# EAGLE board AllOfTheAbove7x13nov (EAGLE 7.7.0)
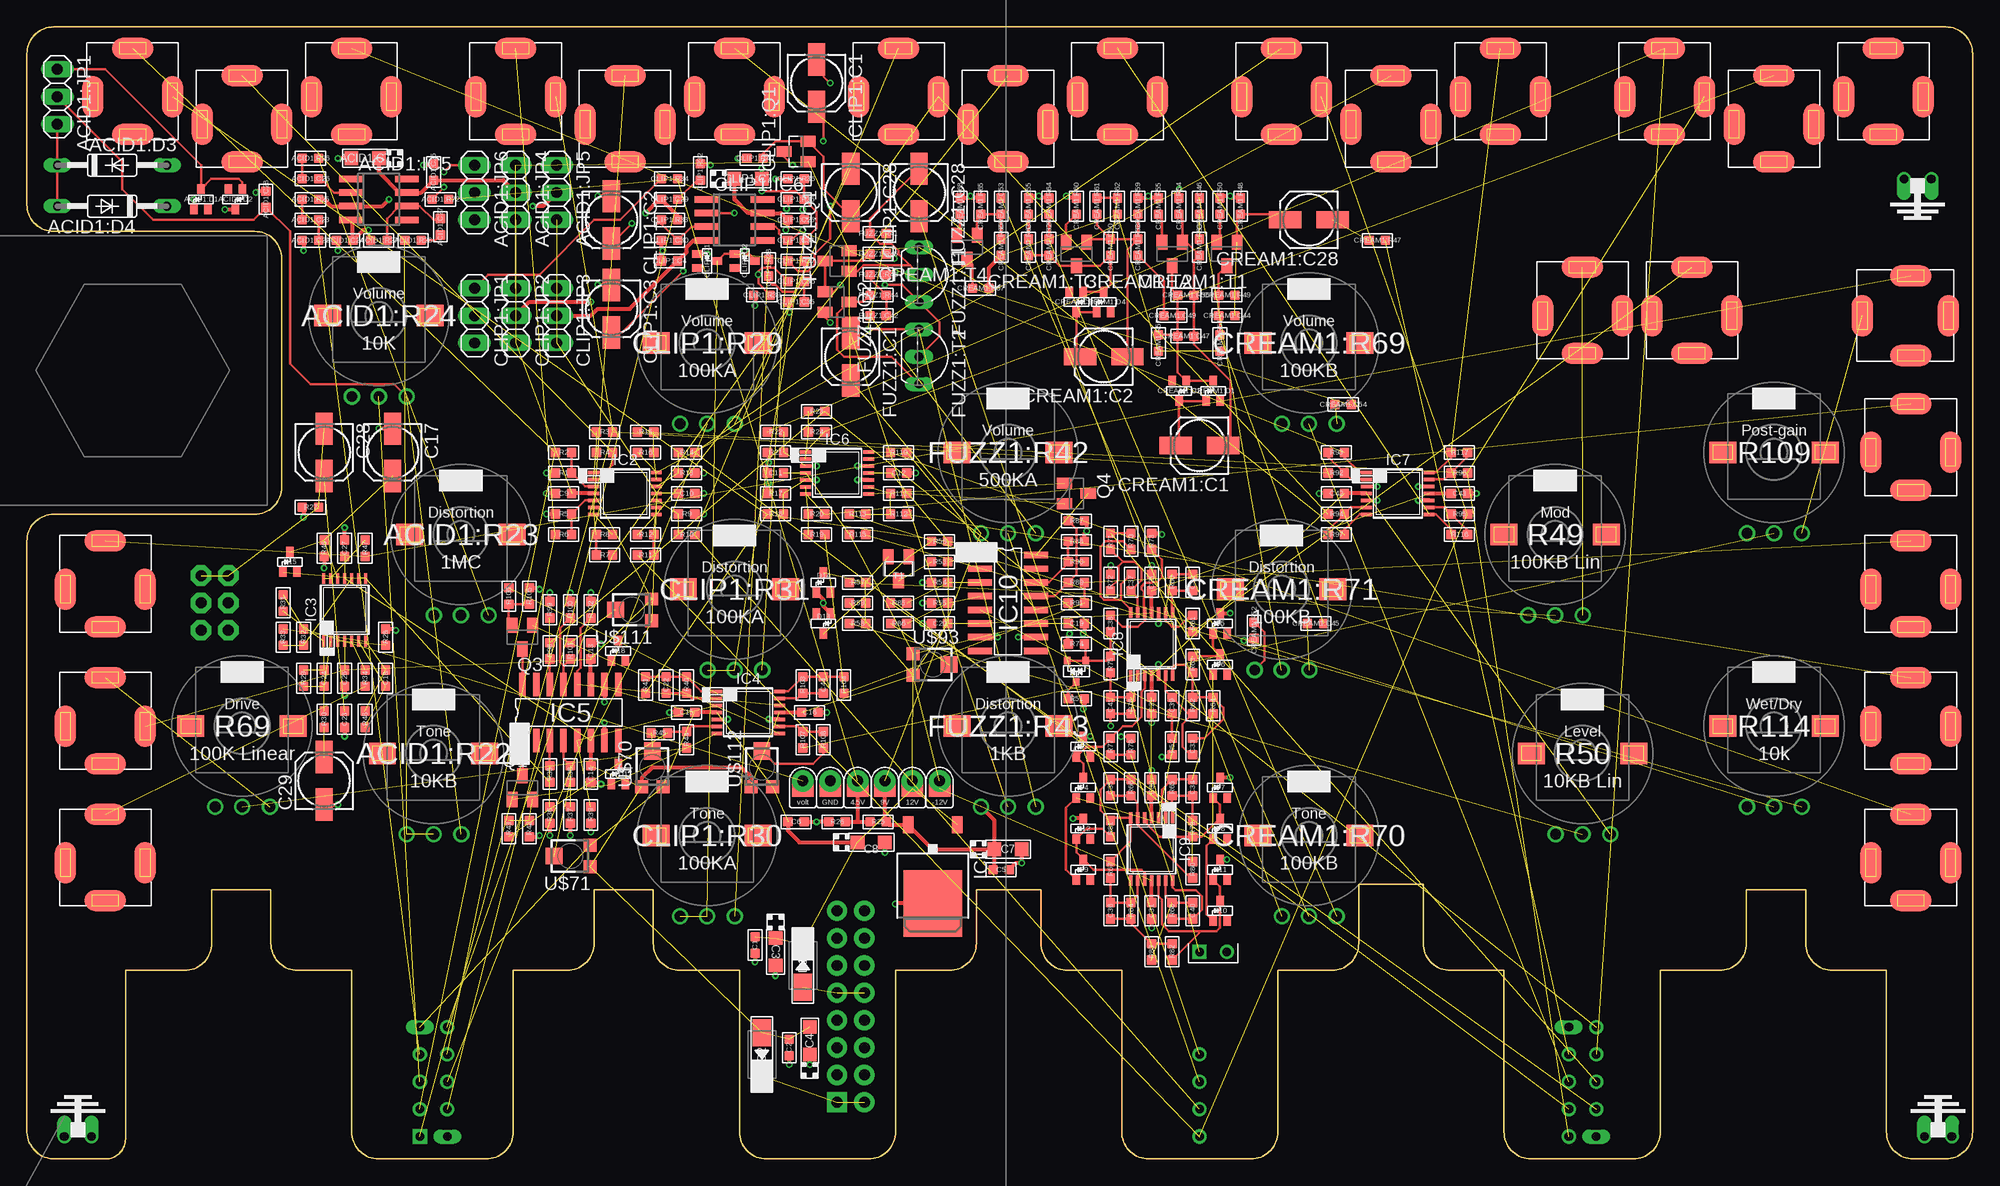
[diagram p10: board, top side]
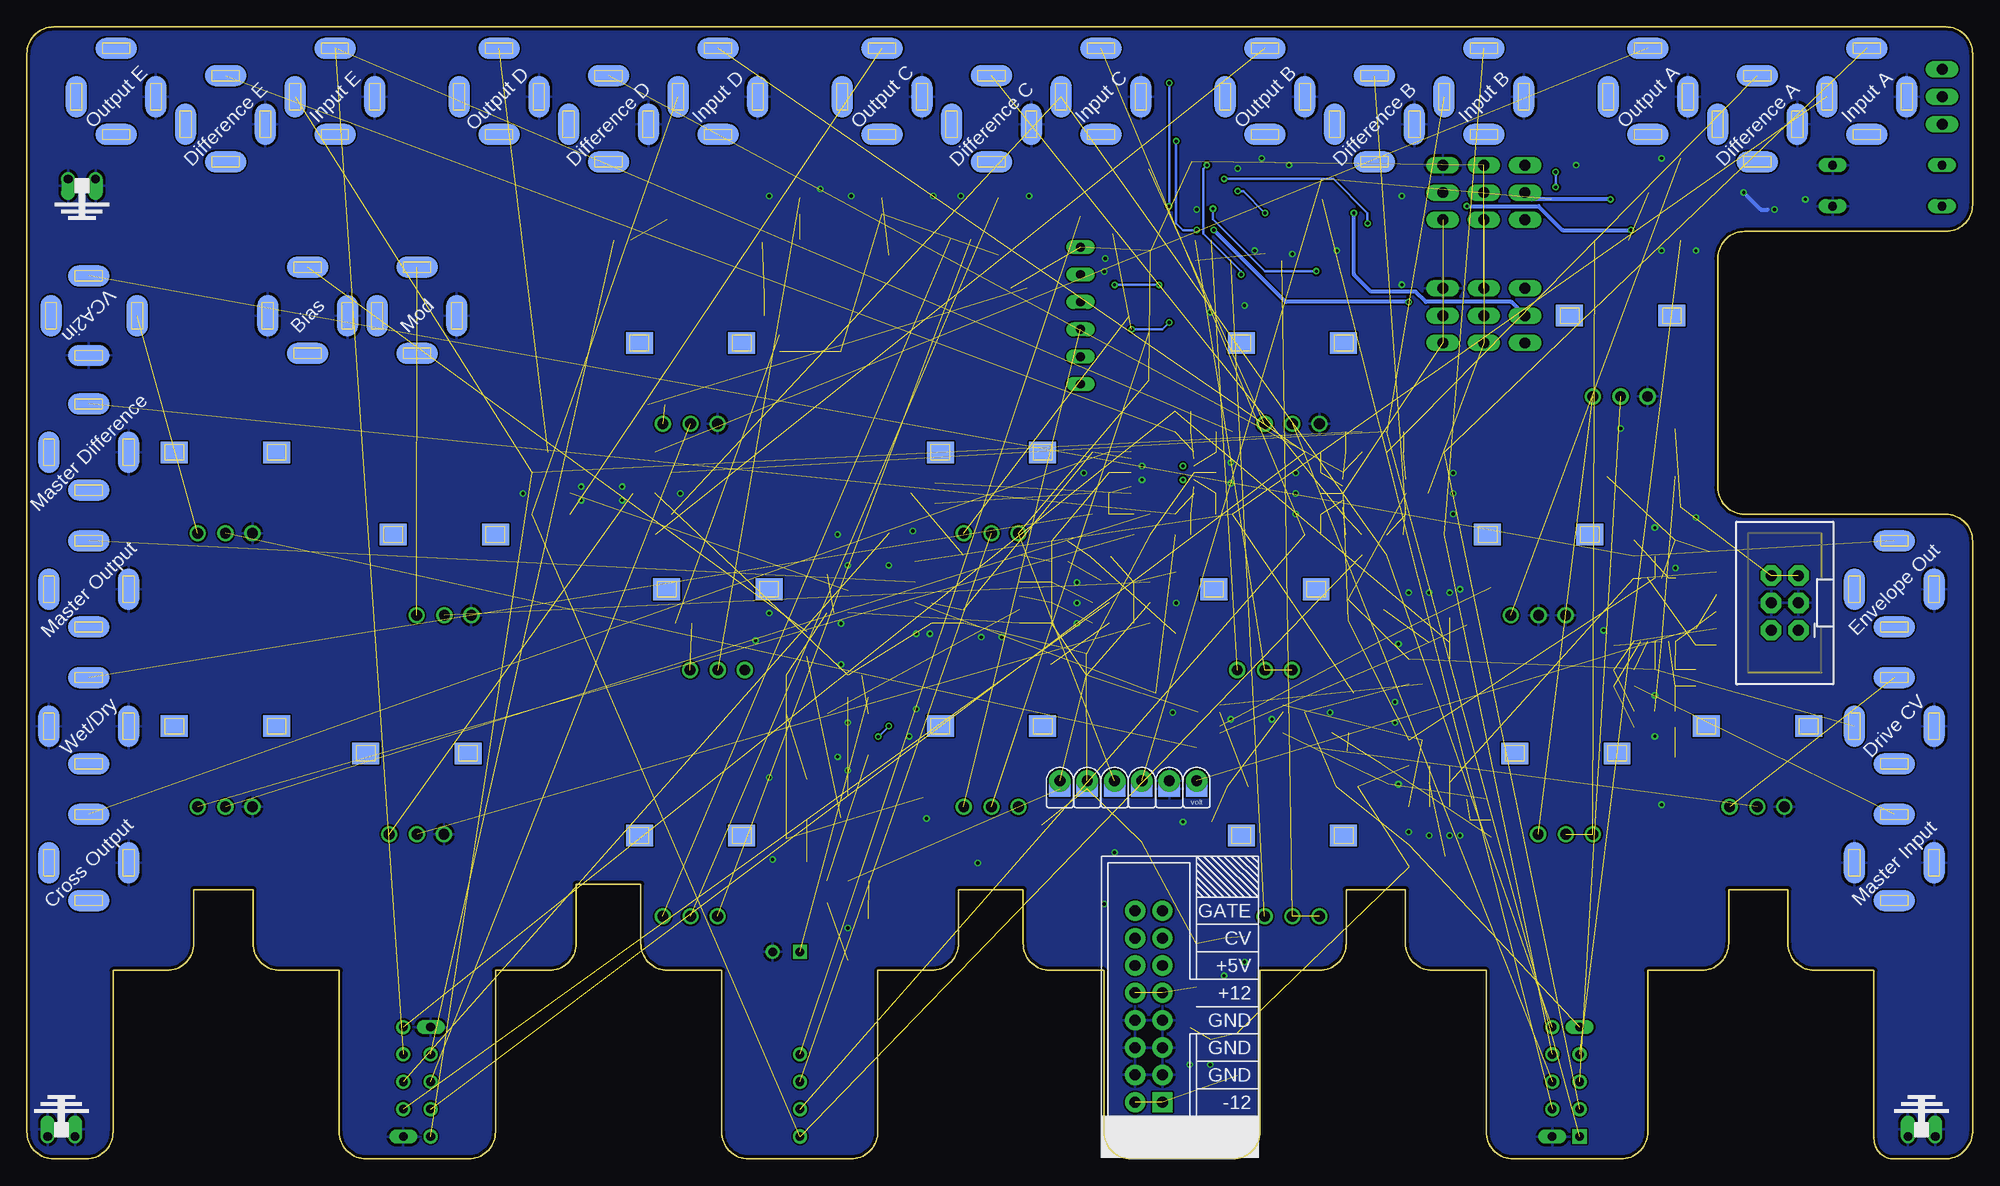
[diagram p11: board, bottom side, seen from below]

Size 180.66 x 105.08 mm. Coordinates in mm from the lower left corner, seen from the top.
Copper layers (1*16): Top 0.035mm / dielectric 1.5mm / Bottom 0.035mm
Design rules "ITeadstudio": minimum track width 6mil, minimum drill 12mil, track to track 6mil, track to pad 6mil, pad to pad 6mil, via to via 6mil, smd to smd 0mil, copper to edge 10mil, drill to drill 10mil, minimum pad ring 10mil, minimum via ring 6mil, stop-mask expansion 2mil, vias tented up to drill 100mil, thermal gap 10mil
Net classes: 0 default: width 0.254 mm; 1 power: width 0.381 mm

## Footprints (pad centres in the part's own frame; a part is rotated, then mirrored left to right if it is on the bottom)
CASE-A_3216 = smd 1.27 x 1.27: + -1.27,0; - 1.27,0
C0603 = smd 0.889 x 0.889: 1 -0.762,0; 2 0.762,0
SOT-323 = smd 0.7 x 0.9: ANODE -0.65,-0.95; CATHODE 0,0.95; NC 0.65,-0.95
DO35-10 = drill 0.813 long: A 5.08,0; C -5.08,0
SO08 = smd 0.6 x 2.2: 1 -1.905,-2.6; 2 -0.635,-2.6; 3 0.635,-2.6; 4 1.905,-2.6; 5 1.905,2.6; 6 0.635,2.6; 7 -0.635,2.6; 8 -1.905,2.6
1X03 = drill 1.016 long: 1 -2.54,0; 2 0,0; 3 2.54,0
ALPS_POT_SQUAREHOLES = drill 1: P$1 -2.5,-7.5; P$2 0,-7.5; P$3 2.58,-7.5 | smd 2.5 x 2: P$4 -4.75,0; P$5 4.75,0 | smd 2.5 x 2 bottom: P$6 -4.75,0; P$7 4.75,0
R0603 = smd 0.889 x 0.889: 1 -0.762,0; 2 0.762,0
153CLV-0505 = smd 3 x 1.6: + 2.2,0; - -2.2,0
SOT23 = smd 1 x 1.4: 1 -0.95,-1.1; 2 0.95,-1.1; 3 0,1.1
SOT23-BEC = smd 1 x 1.4: B -0.95,-1.1; C 0,1.1; E 0.95,-1.1
DO-214AC = smd 2.5 x 1.7: 1 -2,0; 2 2,0
TO92-EBC = drill 0.813 long: B 0,-1.27; C 2.54,-1.27; E -2.54,-1.27
TO252 = smd 1 x 1.6: 1 -2.28,-4.8; 2 2.28,-4.8 | smd 5.4 x 6.2: 3 0,2.5
TSSOP14 = smd 0.305 x 0.991: 1 -1.95,-2.918; 2 -1.3,-2.918; 3 -0.65,-2.918; 4 0,-2.918; 5 0.65,-2.918; 6 1.3,-2.918; 7 1.95,-2.918; 8 1.95,2.918; 9 1.3,2.918; 10 0.65,2.918; 11 0,2.918; 12 -0.65,2.918; 13 -1.3,2.918; 14 -1.95,2.918
SO16 = smd 0.6 x 2.2: 1 -4.445,-2.6; 2 -3.175,-2.6; 3 -1.905,-2.6; 4 -0.635,-2.6; 5 0.635,-2.6; 6 1.905,-2.6; 7 3.175,-2.6; 8 4.445,-2.6; 9 4.445,2.6; 10 3.175,2.6; 11 1.905,2.6; 12 0.635,2.6; 13 -0.635,2.6; 14 -1.905,2.6; 15 -3.175,2.6; 16 -4.445,2.6
3.5MM-JACK-SWITCH-13MM-NOHOLES = smd 1.95 x 3.85 bottom: RING_B@1 -3.7,0; SWITCH_B@1 3.7,0 | smd 1.95 x 3.85: RING_T@3 -3.7,0; SWITCH_T@3 3.7,0 | smd 3.85 x 1.95 bottom: SECOND_B@1 0,-3.5; TIP_B@1 0,4.5 | smd 3.85 x 1.95: SECOND_T@3 0,-3.5; TIP_T@3 0,4.5
POWER_16_SHROUDED = drill 1.016 pad 1.88 square: 1 -8.89,-1.27 | drill 1.016 pad 1.88: 2 -8.89,1.27; 3 -6.35,-1.27; 4 -6.35,1.27; 5 -3.81,-1.27; 6 -3.81,1.27; 7 -1.27,-1.27; 8 -1.27,1.27; 9 1.27,-1.27; 10 1.27,1.27; 11 3.81,-1.27; 12 3.81,1.27; 13 6.35,-1.27; 14 6.35,1.27; 15 8.89,-1.27; 16 8.89,1.27
POWERTESTPAD = drill 1 pad 2: P$1 0,0 | smd 2 x 1.5: P$2 0,-0.75 | smd 2 x 1.5 bottom: P$3 0,-0.75
BYPASSBOARD = drill 0.8 long: 12V 31.75,15.24; GND 34.29,5.08; GND2 138.43,15.24; GND3 140.97,5.08 | drill 0.8 square: P$1 31.75,5.08 | drill 0.8: P$2 31.75,10.16; P$3 31.75,7.62; P$4 31.75,12.7; P$5 34.29,15.24; P$6 34.29,10.16; P$7 34.29,12.7; P$8 34.29,7.62; P$9 104.14,5.08; P$10 104.14,10.16; P$11 104.14,7.62; P$12 104.14,12.7; P$13 138.43,5.08; P$14 138.43,10.16; P$15 138.43,7.62; P$16 138.43,12.7; P$17 140.97,15.24; P$18 140.97,10.16; P$19 140.97,12.7; P$20 140.97,7.62
GROUNDLOOP = drill 0.8 offset: P$1 1.27,0; P$2 -1.27,0
2X3-SHROUDED = drill 1.016 pad 1.88 octagon: 1 -1.27,2.54; 2 1.27,2.54; 3 -1.27,0; 4 1.27,0; 5 -1.27,-2.54; 6 1.27,-2.54
TC33X = smd 1.2 x 1.2: 1 -1,-1.825; 3 1,-1.825 | smd 1.5 x 1.6: 2 0,1.5
SOT23' = smd 0.6 x 0.7: P$1 -0.85,-1; P$2 0.85,-1; P$3 0,1
TESTPAD_DUAL_PTH = drill 0.8 square: P$1 -1.27,0 | drill 0.8: P$2 1.27,0

## Placement (x,y rotation side)
ACID1:C7  10uF  [CASE-A_3216]  31.41,92.89 180 top
ACID1:C22  1nF  [C0603]  26.33,85.27 180 top
ACID1:C23  10nF  [C0603]  26.33,87.17 180 top
ACID1:C24  100n  [C0603]  29.5,85.27 180 top
ACID1:C25  100n  [C0603]  37.76,91.61 90 top
ACID1:C26  47nF  [C0603]  26.33,90.98 0 top
ACID1:C27  1uF  [C0603]  38.39,86.53 270 top
ACID1:C28  1nF  [C0603]  22.2,89.08 270 top
ACID1:D1  BAS16W  [SOT-323]  16.17,89.08 0 top
ACID1:D2  BAS16W  [SOT-323]  19.34,89.08 180 top
ACID1:D3  1N4148DO35-10  [DO35-10]  7.91,92.25 0 top
ACID1:D4  1N4148DO35-10  [DO35-10]  7.91,88.44 180 top
ACID1:IC5  UA741D  [SO08]  32.68,89.08 270 top
ACID1:JP1  [1X03]  2.83,98.6 270 top
ACID1:JP4  [1X03]  45.38,89.71 270 top
ACID1:JP5  [1X03]  49.19,89.71 270 top
ACID1:JP6  [1X03]  41.57,89.71 270 top
ACID1:R22  10KB  [ALPS_POT_SQUAREHOLES]  37.76,37.64 0 top
ACID1:R23  1MC  [ALPS_POT_SQUAREHOLES]  40.3,57.96 0 top
ACID1:R24  10K  [ALPS_POT_SQUAREHOLES]  32.68,78.28 0 top
ACID1:R25  10K  [R0603]  26.33,89.08 180 top
ACID1:R26  4.7K  [R0603]  26.33,92.89 0 top
ACID1:R27  1M  [R0603]  32.68,85.27 0 top
ACID1:R28  5.6K  [R0603]  35.85,85.27 0 top
ACID1:R72  1M  [R0603]  38.39,89.08 0 top
C1  100n  [C0603]  67.6,19.86 90 top
C2  100n  [C0603]  70.78,10.34 270 top
C3  10u  [CASE-A_3216]  69.51,19.23 270 top
C4  10u  [CASE-A_3216]  72.68,10.97 90 top
C5  100n  [C0603]  90.46,26.84 180 top
C6  100n  [C0603]  71.41,31.29 180 top
C7  10u  [CASE-A_3216]  91.1,28.75 0 top
C8  10u  [CASE-A_3216]  78.4,29.38 0 top
C9  100n  [C0603]  49.82,61.77 0 top
C10  100n  [C0603]  61.25,61.77 0 top
C11  100n  [C0603]  69.51,63.67 0 top
C12  100n  [C0603]  80.94,63.67 0 top
C13  100n  [C0603]  52.36,47.16 270 top
C14  100n  [C0603]  52.36,35.73 270 top
C15  100n  [C0603]  61.25,41.45 0 top
C16  100n  [C0603]  72.68,41.45 0 top
C17  10uF  [153CLV-0505]  33.95,65.58 270 top
C18  10pF  [C0603]  33.31,44.62 90 top
C19  100n  [C0603]  97.45,49.7 180 top
C20  100n  [C0603]  84.75,49.7 180 top
C21  100n  [C0603]  104.43,42.09 90 top
C22  10pF  [C0603]  59.35,43.99 90 top
C23  10pF  [C0603]  29.5,40.81 90 top
C24  47pF  [C0603]  27.6,44.62 270 top
C25  100n  [C0603]  104.43,53.52 90 top
C26  100n  [C0603]  29.5,44.62 90 top
C27  100n  [C0603]  29.5,56.69 90 top
C28  10uF  [153CLV-0505]  27.6,65.58 270 top
C29  10uF  [153CLV-0505]  27.6,35.1 90 top
C30  100n  [C0603]  104.43,34.47 270 top
C31  100n  [C0603]  104.43,23.04 270 top
C32  33p  [C0603]  108.24,53.52 90 top
C33  220p  [C0603]  108.24,38.27 270 top
C34  33p  [C0603]  108.24,34.47 90 top
C35  33p  [C0603]  100.62,34.47 270 top
C36  33p  [C0603]  100.62,23.04 90 top
C37  33p  [C0603]  102.53,53.52 270 top
C38  100n  [C0603]  100.62,49.7 270 top
C39  680n  [C0603]  106.34,42.09 90 top
C40  33p FIX  [C0603]  108.24,23.04 90 top
C41  33p FIX  [C0603]  100.62,42.09 270 top
C42  100n  [C0603]  121.58,61.77 0 top
C43  100n  [C0603]  133.01,61.77 0 top
C44  10pF  [C0603]  73.95,43.99 90 top
CLIP1:C1  4.7uF  [153CLV-0505]  73.32,99.87 270 top
CLIP1:C2  2.2uF  [153CLV-0505]  54.27,87.17 270 top
CLIP1:C3  4.7uF  [153CLV-0505]  54.27,78.92 270 top
CLIP1:C4  100n  [C0603]  59.66,83.36 180 top
CLIP1:C7  10uF  [CASE-A_3216]  66.97,90.98 0 top
CLIP1:C25  100n  [C0603]  71.41,87.17 0 top
CLIP1:C28  1uF  [153CLV-0505]  76.49,89.71 270 top
CLIP1:C29  22nF  [C0603]  59.66,89.08 180 top
CLIP1:C30  1nF  [C0603]  59.66,85.27 0 top
CLIP1:C31  100pF  [C0603]  71.41,85.27 180 top
CLIP1:C35  3.3nF  [C0603]  71.41,79.55 180 top
CLIP1:C36  22nF  [C0603]  71.41,81.45 180 top
CLIP1:D1  BAS16W  [SOT-323]  63.16,83.36 270 top
CLIP1:D2  BAS16W  [SOT-323]  66.65,83.36 270 top
CLIP1:IC6  UA741D  [SO08]  65.7,87.17 270 top
CLIP1:JP1  [1X03]  41.57,78.28 270 top
CLIP1:JP2  [1X03]  45.38,78.28 270 top
CLIP1:JP3  [1X03]  49.19,78.28 270 top
CLIP1:Q1  SST201  [SOT23]  71.41,93.52 90 top
CLIP1:R29  100KA  [ALPS_POT_SQUAREHOLES]  63.16,75.74 0 top
CLIP1:R30  100KA  [ALPS_POT_SQUAREHOLES]  63.16,30.02 0 top
CLIP1:R31  100KA  [ALPS_POT_SQUAREHOLES]  65.7,52.88 0 top
CLIP1:R32  1M  [R0603]  62.52,91.61 90 top
CLIP1:R33  1K  [R0603]  59.66,87.17 180 top
CLIP1:R34  1M  [R0603]  59.66,90.98 0 top
CLIP1:R35  560R  [R0603]  71.41,89.08 0 top
CLIP1:R36  47R  [R0603]  71.41,90.98 0 top
CLIP1:R37  1K  [R0603]  71.41,83.36 0 top
CLIP1:R38  1.5K  [R0603]  68.87,82.72 270 top
CLIP1:R39  1M  [R0603]  68.24,80.19 0 top
CLIP1:R40  10K  [R0603]  67.6,92.89 0 top
CREAM1:C1  1uF  [153CLV-0505]  108.88,66.22 180 top
CREAM1:C2  1uF  [153CLV-0505]  99.99,74.47 180 top
CREAM1:C28  1uF  [153CLV-0505]  119.04,87.17 180 top
CREAM1:C44  470pF  [C0603]  111.42,78.28 180 top
CREAM1:C45  1uF  [C0603]  119.67,49.7 180 top
CREAM1:C46  100nF  [C0603]  108.88,88.44 270 top
CREAM1:C47  470pF  [C0603]  107.61,76.38 180 top
CREAM1:C49  100nF  [C0603]  106.34,78.28 180 top
CREAM1:C50  470pF  [C0603]  100.62,84.63 270 top
CREAM1:C52  4nF  [C0603]  94.91,84.63 90 top
CREAM1:C53  100nF  [C0603]  90.46,88.44 270 top
CREAM1:C54  100nF  [C0603]  122.21,70.03 180 top
CREAM1:C55  10nF  [C0603]  93,88.44 270 top
CREAM1:D1  BAS16W  [SOT-323]  110.15,71.3 0 top
CREAM1:D2  BAS16W  [SOT-323]  106.97,71.3 180 top
CREAM1:D3  BAS16W  [SOT-323]  97.45,79.55 180 top
CREAM1:D4  BAS16W  [SOT-323]  99.99,79.55 0 top
CREAM1:R47  39K  [R0603]  125.39,85.27 180 top
CREAM1:R48  47K  [R0603]  112.69,88.44 270 top
CREAM1:R49  470K  [R0603]  111.42,80.19 0 top
CREAM1:R50  100R  [R0603]  110.78,88.44 90 top
CREAM1:R51  10K  [R0603]  110.78,75.74 90 top
CREAM1:R52  1K  [R0603]  113.96,49.07 270 top
CREAM1:R53  10K  [R0603]  108.88,84.63 270 top
CREAM1:R54  100K  [R0603]  106.97,88.44 270 top
CREAM1:R55  150R  [R0603]  105.07,88.44 270 top
CREAM1:R56  470K  [R0603]  107.61,80.19 0 top
CREAM1:R57  10K  [R0603]  105.07,75.74 90 top
CREAM1:R58  10K  [R0603]  103.16,84.63 90 top
CREAM1:R59  100K  [R0603]  103.16,88.44 270 top
CREAM1:R60  150R  [R0603]  97.45,88.44 270 top
CREAM1:R61  470K  [R0603]  99.35,88.44 270 top
CREAM1:R62  10K  [R0603]  101.26,88.44 90 top
CREAM1:R63  39K  [R0603]  93,84.63 90 top
CREAM1:R64  22K  [R0603]  94.91,88.44 90 top
CREAM1:R65  100K  [R0603]  88.56,88.44 270 top
CREAM1:R66  430K  [R0603]  90.46,84.63 270 top
CREAM1:R67  15K  [R0603]  88.56,80.82 0 top
CREAM1:R68  3.3K  [R0603]  86.65,88.44 270 top
CREAM1:R69  100KB  [ALPS_POT_SQUAREHOLES]  119.04,75.74 0 top
CREAM1:R70  100KB  [ALPS_POT_SQUAREHOLES]  119.04,30.02 0 top
CREAM1:R71  100KB  [ALPS_POT_SQUAREHOLES]  116.5,52.88 0 top
CREAM1:T1  2n3904  [SOT23-BEC]  111.42,84 180 top
CREAM1:T2  2n3904  [SOT23-BEC]  106.34,84 180 top
CREAM1:T3  2n3904  [SOT23-BEC]  97.45,84 180 top
CREAM1:T4  2n3904  [SOT23-BEC]  87.29,84.63 180 top
D1  1n4001  [DO-214AC]  72.05,17.95 90 top
D2  1n4001  [DO-214AC]  68.24,9.7 270 top
D3  BAS16W  [SOT-323]  98.08,38.27 0 top
D4  BAS16W  [SOT-323]  98.08,34.47 0 top
D5  BAS16W  [SOT-323]  110.78,49.7 0 top
D6  BAS16W  [SOT-323]  110.78,45.9 0 top
D7  BAS16W  [SOT-323]  110.78,34.47 0 top
D8  BAS16W  [SOT-323]  110.78,30.66 0 top
D9  BAS16W  [SOT-323]  98.08,26.84 0 top
D10  BAS16W  [SOT-323]  110.78,23.04 0 top
D11  BAS16W  [SOT-323]  110.78,26.84 0 top
D12  BAS16W  [SOT-323]  98.08,30.66 0 top
D13  BAS16W  [SOT-323]  73.95,49.7 180 top
D14  BAS16W  [SOT-323]  73.95,53.52 0 top
D15  BAS16W  [SOT-323]  24.42,55.42 0 top
D17  BAS16W  [SOT-323]  54.9,35.73 0 top
D18  BAS16W  [SOT-323]  54.9,47.16 0 top
FUZZ1:C1  20uF  [153CLV-0505]  76.49,74.47 270 top
FUZZ1:C28  2.2uF  [153CLV-0505]  82.84,89.71 270 top
FUZZ1:C42  10nF  [C0603]  79.03,78.28 180 top
FUZZ1:Q1  MMBT3906LT1SMD  [SOT23-BEC]  75.22,83.36 90 top
FUZZ1:Q2  MMBT3906LT1SMD  [SOT23-BEC]  75.22,79.55 270 top
FUZZ1:R41  100K  [R0603]  79.03,85.9 180 top
FUZZ1:R42  500KA  [ALPS_POT_SQUAREHOLES]  91.1,65.58 0 top
FUZZ1:R43  1KB  [ALPS_POT_SQUAREHOLES]  91.1,40.18 0 top
FUZZ1:R44  8.2K  [R0603]  79.03,80.19 180 top
FUZZ1:R45  33K  [R0603]  79.03,84 180 top
FUZZ1:R46  470R  [R0603]  79.03,82.09 180 top
FUZZ1:T1  [TO92-EBC]  84.11,82.09 270 top
FUZZ1:T2  [TO92-EBC]  84.11,74.47 270 top
IC1  7809DT  [TO252]  84.11,26.21 180 top
IC2  TL074TSSOP14  [TSSOP14]  55.54,61.77 270 top
IC3  TL074TSSOP14  [TSSOP14]  29.5,50.98 0 top
IC4  TL074TSSOP14  [TSSOP14]  66.97,41.45 270 top
IC5  LM13700M  [SO16]  50.46,41.45 0 top
IC6  TL074TSSOP14  [TSSOP14]  75.22,63.67 270 top
IC7  TL074TSSOP14  [TSSOP14]  127.29,61.77 270 top
IC8  TL074TSSOP14  [TSSOP14]  104.43,47.8 0 top
IC9  TL074TSSOP14  [TSSOP14]  104.43,28.75 180 top
IC10  LM13700M  [SO16]  91.1,51.61 270 top
J1  JACK  [3.5MM-JACK-SWITCH-13MM-NOHOLES]  174.92,78.28 90 top
J2  POWERSHROUDED  [POWER_16_SHROUDED]  76.49,14.14 90 bottom
J3  JACK  [3.5MM-JACK-SWITCH-13MM-NOHOLES]  174.92,52.88 0 top
J4  JACK  [3.5MM-JACK-SWITCH-13MM-NOHOLES]  45.38,98.6 0 top
J5  JACK  [3.5MM-JACK-SWITCH-13MM-NOHOLES]  55.54,96.06 0 top
J6  JACK  [3.5MM-JACK-SWITCH-13MM-NOHOLES]  9.82,98.6 0 top
J7  JACK  [3.5MM-JACK-SWITCH-13MM-NOHOLES]  30.14,98.6 0 top
J8  JACK  [3.5MM-JACK-SWITCH-13MM-NOHOLES]  19.98,96.06 0 top
J9  JACK  [3.5MM-JACK-SWITCH-13MM-NOHOLES]  65.7,98.6 0 top
J10  JACK  [3.5MM-JACK-SWITCH-13MM-NOHOLES]  174.92,65.58 0 top
J11  JACK  [3.5MM-JACK-SWITCH-13MM-NOHOLES]  80.94,98.6 0 top
J12  JACK  [3.5MM-JACK-SWITCH-13MM-NOHOLES]  91.1,96.06 0 top
J13  JACK  [3.5MM-JACK-SWITCH-13MM-NOHOLES]  101.26,98.6 0 top
J14  JACK  [3.5MM-JACK-SWITCH-13MM-NOHOLES]  116.5,98.6 0 top
J15  JACK  [3.5MM-JACK-SWITCH-13MM-NOHOLES]  126.66,96.06 0 top
J16  JACK  [3.5MM-JACK-SWITCH-13MM-NOHOLES]  136.82,98.6 0 top
J17  JACK  [3.5MM-JACK-SWITCH-13MM-NOHOLES]  152.06,98.6 0 top
J18  JACK  [3.5MM-JACK-SWITCH-13MM-NOHOLES]  162.22,96.06 0 top
J19  JACK  [3.5MM-JACK-SWITCH-13MM-NOHOLES]  172.38,98.6 0 top
J20  JACK  [3.5MM-JACK-SWITCH-13MM-NOHOLES]  7.28,27.48 0 top
J21  JACK  [3.5MM-JACK-SWITCH-13MM-NOHOLES]  7.28,40.18 0 top
J22  JACK  [3.5MM-JACK-SWITCH-13MM-NOHOLES]  144.44,78.28 0 top
J23  JACK  [3.5MM-JACK-SWITCH-13MM-NOHOLES]  154.6,78.28 0 top
J24  JACK  [3.5MM-JACK-SWITCH-13MM-NOHOLES]  7.28,52.88 0 top
J25  JACK  [3.5MM-JACK-SWITCH-13MM-NOHOLES]  174.92,40.18 0 top
J26  JACK  [3.5MM-JACK-SWITCH-13MM-NOHOLES]  174.92,27.48 0 top
PCB1  EURORACK_PCB5STOMP  [EURORACK36HP_5STOMP]  -0.34,-3 0 top
Q1  MMBT3906LT1SMD  [SOT23-BEC]  46.01,34.47 0 top
Q3  MMBT3906LT1SMD  [SOT23-BEC]  46.01,48.44 180 top
Q4  MMBT3906LT1SMD  [SOT23-BEC]  97.45,61.77 270 top
R1  100k  [R0603]  49.82,63.67 180 top
R2  100k  [R0603]  49.82,65.58 180 top
R3  100k  [R0603]  53.63,67.48 0 top
R4  100k  [R0603]  53.63,65.58 180 top
R5  100k  [R0603]  49.82,59.87 180 top
R6  100k  [R0603]  49.82,57.96 180 top
R7  100k  [R0603]  53.63,56.05 0 top
R8  100k  [R0603]  53.63,57.96 180 top
R9  100k  [R0603]  61.25,59.87 0 top
R10  100k  [R0603]  61.25,57.96 0 top
R11  100k  [R0603]  57.44,56.05 180 top
R12  100k  [R0603]  57.44,57.96 0 top
R13  100k  [R0603]  61.25,63.67 0 top
R14  100k  [R0603]  61.25,65.58 0 top
R15  100k  [R0603]  57.44,67.48 180 top
R16  100k  [R0603]  57.44,65.58 0 top
R17  100k  [R0603]  69.51,61.77 180 top
R18  100k  [R0603]  69.51,59.87 180 top
R19  100k  [R0603]  73.32,57.96 0 top
R20  100k  [R0603]  73.32,59.87 180 top
R21  100k  [R0603]  69.51,65.58 180 top
R22  100k  [R0603]  69.51,67.48 180 top
R23  100k  [R0603]  73.32,69.39 0 top
R24  100k  [R0603]  73.32,67.48 180 top
R25  100k  [R0603]  79.03,31.29 0 top
R26  100k  [R0603]  75.22,31.29 0 top
R27  1M  [R0603]  26.33,60.5 0 top
R28  150K  [R0603]  33.31,48.44 270 top
R29  10K  [R0603]  25.69,44.62 90 top
R30  470R  [R0603]  27.6,40.81 90 top
R31  1K  [R0603]  23.79,51.61 90 top
R32  100K  [R0603]  25.69,48.44 90 top
R33  100K  [R0603]  23.79,48.44 90 top
R34  100k  [R0603]  31.41,44.62 90 top
R35  4.7K  [R0603]  48.55,35.73 90 top
R36  10R  [R0603]  48.55,31.92 90 top
R37  10R  [R0603]  50.46,31.92 270 top
R38  100K  [R0603]  50.46,35.73 270 top
R39  100K  [R0603]  52.36,31.92 270 top
R40  100K  [R0603]  61.25,43.99 90 top
R41  1K  [R0603]  57.44,43.99 270 top
R42  10K  [R0603]  46.65,30.66 90 top
R43  100K  [R0603]  44.74,30.66 90 top
R44  100K  [R0603]  61.25,38.91 90 top
R45  330K  [R0603]  58.71,39.55 0 top
R46  330K  [R0603]  27.6,56.69 90 top
R47  1K  [R0603]  31.41,56.69 90 top
R48  100k  [R0603]  31.41,40.81 90 top
R49  100KB Lin  [ALPS_POT_SQUAREHOLES]  141.9,57.96 0 top
R50  10KB Lin  [ALPS_POT_SQUAREHOLES]  144.44,37.64 0 top
R51  14  [R0603]  97.45,42.72 0 top
R52  470K  [R0603]  106.34,38.27 270 top
R53  4K7  [R0603]  84.75,55.42 0 top
R54  100  [R0603]  84.75,53.52 0 top
R55  100  [R0603]  84.75,51.61 0 top
R56  470K  [R0603]  84.75,57.33 0 top
R57  22K  [R0603]  77.13,53.52 180 top
R58  33K  [R0603]  77.13,49.7 180 top
R59  4M7  [R0603]  77.13,51.61 0 top
R60  10K  [R0603]  106.34,53.52 90 top
R61  47K  [R0603]  108.24,49.7 270 top
R62  33K  [R0603]  108.24,42.09 270 top
R63  33K  [R0603]  108.24,45.9 270 top
R64  100K  [R0603]  110.15,42.09 90 top
R65  100K  [R0603]  106.34,34.47 90 top
R66  100K  [R0603]  102.53,34.47 270 top
R67  100K  [R0603]  100.62,26.84 90 top
R68  100K  [R0603]  106.34,23.04 90 top
R69  100K Linear  [ALPS_POT_SQUAREHOLES]  19.98,40.18 0 top
R70  100  [R0603]  102.53,57.33 270 top
R71  100K  [R0603]  100.62,57.33 270 top
R72  10K  [R0603]  100.62,53.52 90 top
R73  220K  [R0603]  104.43,57.33 270 top
R74  10K  [R0603]  97.45,47.8 0 top
R75  6K8  [R0603]  100.62,45.9 90 top
R76  100K  [R0603]  102.53,42.09 90 top
R77  33K  [R0603]  100.62,38.27 90 top
R78  100K  [R0603]  102.53,38.27 90 top
R79  33K  [R0603]  108.24,30.66 90 top
R80  100K  [R0603]  108.24,26.84 90 top
R81  33K  [R0603]  100.62,30.66 90 top
R82  33K  [R0603]  106.34,19.23 90 top
R83  100K  [R0603]  104.43,19.23 90 top
R84  100K  [R0603]  102.53,23.04 90 top
R85  27k  [R0603]  80.94,51.61 180 top
R86  150k  [R0603]  80.94,49.7 180 top
R87  1k  [R0603]  97.45,59.23 180 top
R88  1k  [R0603]  97.45,57.33 180 top
R89  200k  [R0603]  97.45,53.52 0 top
R90  200k  [R0603]  97.45,55.42 0 top
R91  47k  [R0603]  97.45,51.61 180 top
R92  100k  [R0603]  121.58,63.67 0 top
R93  100k  [R0603]  121.58,65.58 0 top
R94  100k  [R0603]  121.58,59.87 0 top
R95  100k  [R0603]  133.01,59.87 180 top
R96  100k  [R0603]  133.01,63.67 180 top
R97  100k  [R0603]  121.58,57.96 0 top
R98  4.7K  [R0603]  48.55,47.16 270 top
R99  10R  [R0603]  48.55,50.98 270 top
R100  10R  [R0603]  50.46,50.98 90 top
R101  100K  [R0603]  50.46,47.16 90 top
R102  100K  [R0603]  52.36,50.98 90 top
R103  100K  [R0603]  72.05,43.99 90 top
R104  1K  [R0603]  75.86,43.99 270 top
R105  10K  [R0603]  46.65,52.24 270 top
R106  100K  [R0603]  44.74,52.24 270 top
R107  100K  [R0603]  72.05,38.91 90 top
R108  330K  [R0603]  73.95,38.91 90 top
R109  [ALPS_POT_SQUAREHOLES]  162.22,65.58 0 top
R110  47k  [R0603]  80.94,65.58 0 top
R111  2.2k  [R0603]  80.94,61.77 180 top
R112  18k  [R0603]  80.94,59.87 0 top
R113  18k  [R0603]  77.13,59.87 180 top
R114  10k  [ALPS_POT_SQUAREHOLES]  162.22,40.18 0 top
R115  14k  [R0603]  77.13,57.96 0 top
R116  100k  [R0603]  133.01,57.96 180 top
R117  100k  [R0603]  133.01,65.58 180 top
T1  3906  [SOT23-BEC]  80.94,54.78 180 top
U$13  VOLTAGETESTPAD  [POWERTESTPAD]  82.21,35.1 0 top
U$15  VOLTAGETESTPAD  [POWERTESTPAD]  72.05,35.1 0 top
U$22  5STOMPBOARD  [BYPASSBOARD]  4.74,-3 0 top
U$23  HEADPHONEHOLE_BIGGAP  [HEADPHONEHOLE_GAP]  9.82,73.2 180 top
U$41  VOLTAGETESTPAD  [POWERTESTPAD]  84.75,35.1 0 top
U$42  VOLTAGETESTPAD  [POWERTESTPAD]  79.67,35.1 0 top
U$43  VOLTAGETESTPAD  [POWERTESTPAD]  74.59,35.1 0 top
U$44  VOLTAGETESTPAD  [POWERTESTPAD]  77.13,35.1 0 top
U$48  GNDLOOP  [GROUNDLOOP]  177.46,2.08 180 top
U$49  GNDLOOP  [GROUNDLOOP]  175.55,90.98 0 top
U$50  GNDLOOP  [GROUNDLOOP]  4.74,2.08 180 top
U$68  HEADPHONE  [2X3-SHROUDED]  17.44,51.61 180 bottom
U$70  100k  [TC33X]  58.08,36.37 0 top
U$71  100k  [TC33X]  50.46,28.11 90 top
U$74  BAT54S  [SOT23']  97.45,45.26 180 top
U$92  TESTPOINT_DUAL_PTH  [TESTPAD_DUAL_PTH]  110.15,19.23 0 top
U$93  50K  [TC33X]  84.11,45.9 270 top
U$111  100k  [TC33X]  56.17,50.98 90 top
U$112  100k  [TC33X]  68.24,36.37 0 top

## Tracks (layer width: path | path; a pad name or v marks a point on that pad's centre or on a via)
4.5V  (2 unrouted)
  Top 0.381: R26.2 77.13,31.29 | 77.13,31.29 R25.1 | U$44.P$2 77.13,31.29
9V  (11 unrouted)
  Top 0.381: CREAM1:R67.2 89.32,82.72 CREAM1:R66.2 | C5.2 89.83,26.97 C7.+ | C7.+ 89.83,31.45 FUZZ1:R43.P$1 | C7.+ 84.09,28.75 IC1.2 80.07,31.01 R25.2 79.67,31.42 U$42.P$2
12V  (28 unrouted)
  Top 0.381: IC4.4 C15.2 | IC7.4 C42.2 | IC8.4 C21.2 | IC9.4 C30.2 | C8.+ 71.73,29.38 70.65,30.47 C6.2 | IC5.11 C13.2 | IC2.4 C9.2
-12V  (24 unrouted)
  Top 0.381: IC4.11 C16.1 | IC7.11 C43.1 | IC8.11 C25.1 | C31.1 IC9.11 | U$70.1 57.12,34.59 57.12,35.42 58.08,36.37 66.33,36.37 67.28,35.42 67.28,34.59 U$112.1 | IC5.6 C14.1
ACID1:ACIDNE  (via drill 0.3)
  Top 0.381: ACID1:JP5.2 47.92,88.44 v46.96,88.44 | v31.72,86.22 31.21,86.22 ACID1:C24.1 30.26,86.98 ACID1:IC5.4
  Bottom 0.381: v46.96,88.44 40.3,88.44 38.07,86.22 v31.72,86.22
ACID1:ACIDPL
  Top 0.381: ACID1:C7.+ 32.68,91.61 34.58,89.71 ACID1:IC5.7 36.61,89.71 ACID1:C25.1 44.23,90.85 ACID1:JP4.2
ACID1:ACIDVI  (via drill 0.3)
  Top 0.381: v33.63,89.08 32.99,88.44 ACID1:IC5.3 28.23,88.44 27.6,89.08 ACID1:R25.1
  Bottom 0.381: v33.63,89.08 40.93,89.08 ACID1:JP6.2
ACID1:N$2
  Top 0.254: ACID1:D4.A ACID1:D3.C ACID1:JP1.3
ACID1:N$3
  Top 0.254: ACID1:JP1.1 7.28,101.14 16.17,92.25 ACID1:D1.CATHODE 17.12,90.98 19.66,90.98 19.99,90.65 ACID1:D2.ANODE
ACID1:N$20
  Top 0.254: ACID1:R25.2 ACID1:C23.2
ACID1:N$22  (1 unrouted)
  Top 0.254: ACID1:C26.2 27.28,90.98 28.55,89.71 ACID1:IC5.2
ACID1:N$23
  Top 0.254: ACID1:C26.1 ACID1:R26.1
ACID1:N$32
  Top 0.254: ACID1:C27.1 38.26,87.17 37.76,87.17 36.49,88.44 ACID1:IC5.6 34.58,88.44 33.44,87.3 ACID1:R27.2
ACID1:N$33  (1 unrouted)
ACID1:N$34  (1 unrouted)
  Top 0.254: ACID1:JP1.2 8.86,92.57 8.86,90.03 11.72,87.17 21.05,87.17 ACID1:C28.2 24.42,86.09 24.42,73.83 26.33,71.93 34.11,71.93 ACID1:R24.P$3
ACID1:N$35
  Top 0.254: ACID1:C27.2 37.88,85.27 ACID1:R28.2
ACID1:N$36  (2 unrouted)
ACID1:TO4.5V  (via drill 0.3)
  Top 0.254: ACID1:R72.1 38.71,90.15 v38.71,90.2 | v38.71,91.61 39.34,92.25 ACID1:JP6.1
  Bottom 0.254: v38.71,90.2 v38.71,91.61
BIASINPUT  (1 unrouted)
BIASMAINLINE  (3 unrouted)
  Top 0.254: IC8.8 106.34,50.76 R60.1 C32.1 | D10.ANODE 109.5,22.71 109.5,26.46 109.51,26.47 109.51,29.09 D8.ANODE | D9.ANODE 96.49,26.83 96.49,32.58 D4.ANODE
CLIP1:CLIPNE
  Top 0.381: CLIP1:IC6.4 61.89,85.27 61.25,84.63 61.25,84.19 CLIP1:C4.1 55.98,78.92 53,78.92 52.36,78.28 CLIP1:JP3.2
CLIP1:CLIPPL  (via drill 0.3)
  Top 0.381: CLIP1:C7.+ 65.7,89.08 66.97,87.81 CLIP1:IC6.7 70.01,87.81 CLIP1:C25.1 70.65,86.41 v70.46,86.22 | CLIP1:JP2.2 46.65,79.55 v52.36,79.55
  Bottom 0.381: v52.36,79.55 63.79,79.55 67.44,83.2 v70.46,86.22
CLIP1:CLIPVI  (via drill 0.3)
  Top 0.381: v57.44,87.81 58.71,89.08 CLIP1:C29.2 60.43,87.55 CLIP1:R33.1
  Bottom 0.381: CLIP1:JP1.2 42.84,79.55 50.77,79.55 51.73,80.5 55.85,80.5 57.44,82.09 v57.44,87.81
CLIP1:N$38
  Top 0.254: CLIP1:IC6.3 61.69,86.53 CLIP1:C30.2 58.9,86.79 CLIP1:R33.2
CLIP1:N$41
  Top 0.254: CLIP1:R34.1 55.09,87.17 52.68,87.17 47.6,82.09 42.84,82.09 CLIP1:JP1.1
CLIP1:N$42  (via drill 0.3)  (2 unrouted)
  Top 0.254: CLIP1:C31.1 73.32,86.41 73.32,87.93 CLIP1:R35.2 | CLIP1:R35.2 CLIP1:R36.2 | CLIP1:IC6.2 v65.7,87.81 | v68.24,89.83 71.42,89.83 CLIP1:R35.2
  Bottom 0.254: v65.7,87.81 67.72,89.83 v68.24,89.83
CLIP1:N$43  (via drill 0.3)  (1 unrouted)
  Top 0.254: CLIP1:IC6.6 69.51,86.53 69.82,86.22 69.82,85.9 70.46,85.27 CLIP1:C31.2 70.95,85.27 71.68,85.99 71.82,85.99 v72.05,86.22 | CLIP1:C1.+ 73.95,97.03 v73.95,94.47
  Bottom 0.254: v73.95,94.47 73.95,86.85 73.32,86.22 v72.05,86.22
CLIP1:N$44  (via drill 0.3)
  Top 0.254: CLIP1:R37.1 71.6,82.41 72.51,82.41 73.14,83.04 73.14,83.98 74.59,85.42 v74.59,88.44 | v74.59,99.87 73.32,101.14 CLIP1:C1.-
  Bottom 0.254: v74.59,88.44 v74.59,99.87
CLIP1:N$45  (3 unrouted)
  Top 0.254: CLIP1:D1.CATHODE 64.76,84.01 CLIP1:D2.ANODE
CLIP1:N$46  (1 unrouted)
CLIP1:N$47  (via drill 0.3)
  Top 0.254: CLIP1:R36.1 v69.51,90.98 | v56.17,86.85 54.29,84.97 CLIP1:C2.+
  Bottom 0.254: v69.51,90.98 68.24,90.98 59.35,90.98 56.17,87.81 v56.17,86.85
CLIP1:N$48  (via drill 0.3)
  Top 0.254: CLIP1:C3.+ 55.24,76.72 v60.93,82.41 | v70.53,88.2 70.65,88.31 CLIP1:R35.1
  Bottom 0.254: v60.93,82.41 65.7,82.41 70.53,87.25 v70.53,88.2
CLIP1:N$49
  Top 0.254: CLIP1:C35.1 CLIP1:C36.1 71.22,80.5 70.14,80.5 69.51,81.14 69.19,81.14 68.87,81.45 CLIP1:R38.2
CLIP1:N$50  (via drill 0.3)
  Top 0.254: CLIP1:R39.2 67.92,81.26 v67.92,82.09 67.92,82.41 68.24,82.72 69.38,82.72 CLIP1:C36.2 | v71.09,92.25 70.31,93.03 CLIP1:Q1.3
  Bottom 0.254: v67.92,82.09 67.92,82.41 71.41,85.9 71.41,91.93 v71.09,92.25
CLIP1:N$51
  Top 0.254: CLIP1:R40.2 68.36,93.33 69.51,94.47 70.46,94.47 CLIP1:Q1.2 73.95,93.03 73.95,90.05 CLIP1:C28.+
CLIP1:N$52  (1 unrouted)
CREAM1:N$1  (1 unrouted)
CREAM1:N$61  (2 unrouted)
  Top 0.254: CREAM1:C28.+ 116.33,87.68 CREAM1:R48.2 112.37,87.36 CREAM1:T1.B
CREAM1:N$62
  Top 0.254: CREAM1:R50.1 110.78,85.41 CREAM1:T1.E
CREAM1:N$63  (1 unrouted)
  Top 0.254: CREAM1:T1.C 110.65,82.13 CREAM1:R49.1 CREAM1:C44.2 110.78,78.15 CREAM1:R51.2
CREAM1:N$64  (1 unrouted)
CREAM1:N$65
  Top 0.254: CREAM1:R54.2 107.29,87.36 CREAM1:T2.B 107.65,85.09 CREAM1:R53.2 108.37,83.36 CREAM1:R56.2 CREAM1:C47.1 108.37,75.61 111.73,72.25 111.73,66.87 CREAM1:C1.-
CREAM1:N$66
  Top 0.254: CREAM1:D1.ANODE CREAM1:D2.CATHODE 106.97,66.51 CREAM1:C1.+
CREAM1:N$67
  Top 0.254: CREAM1:R55.2 105.39,87.36 CREAM1:T2.E
CREAM1:N$68
  Top 0.254: CREAM1:C47.2 106.72,76.5 CREAM1:R57.2 | CREAM1:C47.2 106.84,78.03 CREAM1:C49.1 106.84,78.53 CREAM1:R56.1 106.34,80.69 CREAM1:T2.C | CREAM1:D1.CATHODE CREAM1:D2.ANODE 106.84,73.02 CREAM1:C47.2
CREAM1:N$69
  Top 0.254: CREAM1:C49.2 105.57,81.45 CREAM1:R58.1
CREAM1:N$70
  Top 0.254: CREAM1:T3.B 98.69,85.39 CREAM1:C50.1 | CREAM1:C50.1 CREAM1:R58.2 | CREAM1:R59.2 CREAM1:R58.2 | CREAM1:C50.1 99.35,86.66 CREAM1:R61.2 | CREAM1:C2.- 102.19,84.42 CREAM1:R58.2
CREAM1:N$71
  Top 0.254: CREAM1:R60.2 96.5,86.73 CREAM1:T3.E
CREAM1:N$72  (1 unrouted)
  Top 0.254: CREAM1:R63.1 CREAM1:C52.1 95.88,82.89 CREAM1:T3.C 99.65,82.89 CREAM1:C50.2 100.62,81.14 CREAM1:D4.CATHODE CREAM1:D3.ANODE | CREAM1:R61.1 CREAM1:R62.2
CREAM1:N$73  (1 unrouted)
CREAM1:N$74  (1 unrouted)
  Top 0.254: CREAM1:C55.2 CREAM1:R63.2
CREAM1:N$75  (1 unrouted)
  Top 0.254: CREAM1:R64.1 CREAM1:C52.2
CREAM1:N$76
  Top 0.254: CREAM1:D4.ANODE CREAM1:D3.CATHODE 97.45,74.81 CREAM1:C2.+
CREAM1:N$77
  Top 0.254: CREAM1:T4.B 88.24,87.36 CREAM1:R65.2 CREAM1:C53.2 CREAM1:R66.1
CREAM1:N$78  (1 unrouted)
  Top 0.254: CREAM1:T4.C 87.79,83.02 CREAM1:R67.1
CREAM1:N$79
  Top 0.254: CREAM1:R68.2 86.65,86.05 CREAM1:T4.E
CREAM1:N$80  (1 unrouted)
CREAM1:N$84
  Top 0.254: CREAM1:R52.1 114.91,48.88 114.91,46.29 CREAM1:R71.P$1
CREAM1:N$85  (1 unrouted)
CREAM1:N$86  (1 unrouted)
CROSSFADER_OUT  (2 unrouted)
CV_IN  (1 unrouted)
ENVELOPE_OUT  (2 unrouted)
EURORACK_IN  (1 unrouted)
FUZZ1:N$53  (via drill 0.3)  (2 unrouted)
  Top 0.254: FUZZ1:T2.E v78.08,77.01 | v74.59,77.64 74.12,78.11 FUZZ1:Q2.E
  Bottom 0.254: v78.08,77.01 75.22,77.01 v74.59,77.64
FUZZ1:N$54
  Top 0.254: FUZZ1:Q1.B 77.13,82.41 77.67,82.95 81.98,82.95 | FUZZ1:T1.B 81.98,82.95 | 81.98,82.95 80.94,84 80.94,84.31 80.3,84.95 79.22,84.95 FUZZ1:R41.2 78.27,87.34 FUZZ1:C28.-
FUZZ1:N$55  (via drill 0.3)
  Top 0.254: FUZZ1:R45.2 77.63,83.36 FUZZ1:Q1.C FUZZ1:Q2.B 74.9,80.5 v75.54,81.14 | v79.67,81.14 81.25,81.14 FUZZ1:T1.C 84.75,77.64 84.75,76.38 FUZZ1:T2.B
  Bottom 0.254: v79.67,81.14 v75.54,81.14
FUZZ1:N$56  (1 unrouted)
FUZZ1:N$57  (1 unrouted)
FUZZ1:N$58
  Top 0.254: FUZZ1:C42.1 FUZZ1:R44.1 78.27,81.71 FUZZ1:R46.2
FUZZ1:N$59
  Top 0.254: FUZZ1:R44.2 77.63,79.55 FUZZ1:Q2.C 75.22,78.45 75.22,75.11 75.86,74.47 80.3,74.47 FUZZ1:T2.C
GND  (via drill 0.3)
  Top 0.381: ACID1:C7.- v28.87,92.89 | ACID1:C28.1 21.37,89.84 v21.25,89.71 | ACID1:D2.CATHODE v18.39,88.12 | ACID1:D1.ANODE 15.52,89.06 v15.53,89.08 | C17.- 32.7,67.78 v32.68,67.8 | ACID1:C22.2 25.69,85.14 v25.69,84.31 | ACID1:C24.2 28.87,85.14 v28.87,84.31 | ACID1:C25.2 37.63,92.25 v36.8,92.25 | CLIP1:D1.ANODE 63.14,84.01 v63.16,84 | CLIP1:C2.- 53.02,89.37 v53,89.39 | CLIP1:C3.- 53.03,81.11 v53,81.15 | CLIP1:C30.1 58.9,84.44 v59.03,84.31 58.9,84.19 CLIP1:C4.2 | CLIP1:R32.2 63.35,92.38 v63.47,92.25 | CLIP1:R40.1 v66.01,92.89 | CLIP1:C7.- v68.24,91.93 | CLIP1:C25.2 72.05,87.3 v72.05,88.12 | FUZZ1:R45.1 80.11,84 v80.52,83.58 | FUZZ1:R46.1 80.07,82.37 v80.62,82.37 | CLIP1:R39.1 67.6,80.06 v67.6,79.23 | CLIP1:C35.2 70.78,79.42 v70.78,78.6 | CLIP1:D2.CATHODE v66.65,84.31 | CREAM1:R68.1 87.41,89.2 v87.6,89.39 87.79,89.2 CREAM1:R65.1 | CREAM1:C55.1 93.19,89.39 v93.95,89.39 94.14,89.2 CREAM1:R64.2 | CREAM1:R60.1 96.68,89.2 v96.49,89.39 | CREAM1:R59.1 103.92,89.2 v104.11,89.39 104.3,89.2 CREAM1:R55.1 | CREAM1:R54.1 v106.97,90.03 | CREAM1:R50.2 110.97,89.39 v111.73,89.39 111.92,89.2 CREAM1:R48.1 | C42.1 v119.99,61.77 | IC7.3 125.37,62.42 v125.39,62.41 | IC7.5 125.37,61.12 v125.39,61.14 | IC7.12 130.19,62.41 v129.2,62.41 | IC7.10 129.21,61.12 v129.2,61.14 | C43.2 v134.59,61.77 | C12.2 v82.52,63.67 | IC6.12 78.12,64.31 v77.13,64.31 | IC6.10 77.14,63.03 v77.13,63.04 | R21.2 68.87,65.45 v68.87,64.63 68.74,64.5 C11.1 | R17.2 68.74,62.6 v68.87,62.72 | R13.2 v62.84,63.67 | C10.2 v62.84,61.77 | R9.2 v62.84,59.87 | R1.2 v48.23,63.67 | C9.1 v48.23,61.77 | R5.2 v48.23,59.87 | R99.1 v48.55,52.56 | R100.2 v50.46,52.56 | R102.2 v52.36,52.56 | R105.1 47.47,53.01 v47.6,52.88
  Top 0.381: R27.1 25.69,60.37 v25.69,59.55 | C27.2 v29.5,58.59 | R46.1 v27.6,54.84 | IC1.3 80.66,23.71 v80.62,23.67 | C8.- v79.67,28.43 | C7.- v92.37,27.48 91.86,27.48 C5.1 | D12.CATHODE v97.13,31.6 v97.13,31.61 | D3.CATHODE v98.72,39.23 | R51.2 98.21,41.9 v98.08,41.77 | R74.1 96.68,48.63 v96.81,48.75 | C19.1 98.21,48.88 v98.08,48.75 | R88.1 98.21,58.09 v98.4,58.28 98.4,59.04 R87.1 | R73.1 105.26,58.09 v105.38,57.96 | R28.1 34.14,49.2 v34.26,49.07 | C26.1 v29.5,43.04 | C23.1 v29.5,39.23 | C29.- 27.62,32.88 v28.87,32.88 | R36.1 v48.55,30.02 | R37.2 v50.46,30.02 | R39.2 v52.36,30.34 | R42.1 47.47,29.89 v47.6,30.02 | C6.1 v73.32,31.29 R26.1 | C13.1 53.19,47.93 v53.31,47.8 | IC5.10 v53.63,42.4 | IC5.7 v53.63,40.5 | C14.2 53.12,34.97 v53.31,34.78 | C4.+ v72.68,8.75 | C2.2 v70.78,8.75 | C3.- v69.51,17 | C1.1 v67.6,18.27 | C15.1 v59.66,41.45 | IC4.5 65.05,40.8 v65.06,40.81 | IC4.10 v68.89,40.8 v68.87,40.81 | C16.2 v74.27,41.45 | D13.ANODE 73.95,51.3 v73.95,51.61 73.95,51.91 D14.ANODE | R54.1 v83.16,53.52 | R55.1 v83.16,51.61 | C20.2 v83.16,49.7 | IC10.7 v90.14,48.44 | IC10.10 v92.05,48.44 | IC8.5 105.07,44.9 v105.07,45.9 | IC8.10 105.08,49.72 v105.07,49.7 | C21.1 v104.43,40.5 | R52.2 106.15,37.32 v105.38,37.32 | C25.2 v104.43,55.1 | R72.2 v100.62,55.1 | CREAM1:R52.2 113.76,48.12 v113,48.12 | D5.CATHODE v111.73,50.66 | D7.CATHODE v111.73,35.41 v111.73,35.42 | C30.1 v104.43,36.05 | D11.CATHODE v111.42,27.8 | C31.2 v104.43,21.45
  Bottom 0.381: v21.25,89.71 19.66,88.12 19.02,88.12 | v53,81.15 53,81.14 | v80.52,83.58 80.62,83.68 | v80.62,82.37 80.62,82.41
  pour Bottom: -0.34,106.22 -0.34,0.81 -0.98,0.17 181.27,0.17 181.58,0.49 181.58,106.54 181.27,106.86 0.29,106.86
GUITAR_IN  (3 unrouted)
GUITAR_OUT  (2 unrouted)
INPUT_A  (2 unrouted)
INPUT_B  (2 unrouted)
INPUT_C  (2 unrouted)
INPUT_D  (2 unrouted)
INPUT_E  (2 unrouted)
INPUT_WS  (1 unrouted)
MIX_OUT  (3 unrouted)
N$1
  Top 0.254: R93.1 120.81,65.2 R92.2 122.94,63.07 IC7.2
N$2  (2 unrouted)
N$3  (2 unrouted)
N$4  (1 unrouted)
  Top 0.254: ACID1:C22.1 ACID1:C23.1
N$5  (1 unrouted)
N$6  (1 unrouted)
  Top 0.254: IC7.1 123.75,63.72 122.34,65.14 R93.2
N$7  (1 unrouted)
  Top 0.254: CLIP1:C29.1 62.2,90.85 CLIP1:R32.1
N$8  (1 unrouted)
N$9  (1 unrouted)
N$10  (1 unrouted)
N$11  (1 unrouted)
N$12  (1 unrouted)
N$13
  Top 0.254: IC7.6 122.94,60.47 R94.2 120.81,58.34 R97.1
N$14  (3 unrouted)
N$15
  Top 0.254: IC2.3 51.84,62.42 R1.1 R2.1
N$16  (3 unrouted)
N$17  (3 unrouted)
N$18  (1 unrouted)
  Top 0.254: IC2.1 53.68,63.72 54.39,64.44 R4.1
N$19
  Top 0.254: R6.1 R5.1 51.84,61.12 IC2.5
N$20  (1 unrouted)
  Top 0.254: R7.1 R8.2
N$21  (1 unrouted)
N$22  (1 unrouted)
N$23  (2 unrouted)
N$24  (2 unrouted)
N$25  (1 unrouted)
  Top 0.254: R11.1 R12.2
N$26  (1 unrouted)
N$27  (1 unrouted)
N$28  (2 unrouted)
N$29  (2 unrouted)
N$30  (2 unrouted)
N$31  (1 unrouted)
  Top 0.254: IC7.7 123.75,59.82 122.34,58.4 R97.2
N$32
  Top 0.254: IC7.9 131.64,60.47 R95.2 133.77,58.34 R116.1
N$33  (2 unrouted)
N$34  (via drill 0.3)  (2 unrouted)
  Top 0.254: IC6.5 72.32,63.04 v73.32,63.04
N$35  (2 unrouted)
N$36  (1 unrouted)
  Top 0.254: IC7.8 130.83,59.82 132.24,58.4 R116.2
N$37
  Top 0.254: IC7.13 131.64,63.07 R96.2 133.77,65.2 R117.1
N$38  (2 unrouted)
N$39  (via drill 0.3)  (2 unrouted)
  Top 0.254: IC6.3 73.3,64.33 v73.32,64.31
N$40  (2 unrouted)
N$42  (1 unrouted)
  Top 0.254: IC7.14 130.83,63.72 132.24,65.14 R117.2
N$43  (2 unrouted)
N$44  (3 unrouted)
N$45  (1 unrouted)
N$46  (3 unrouted)
N$47  (1 unrouted)
N$48  (1 unrouted)
  Top 0.254: R38.1 49.82,37.13 IC5.4
N$49  (1 unrouted)
  Top 0.254: IC5.3 R35.2
N$50  (2 unrouted)
N$51
  Top 0.254: IC4.2 61.73,42.75 R40.1 C22.1
N$52
  Top 0.254: R41.1 C22.2 R40.2 62.6,43.4 IC4.1
N$53  (1 unrouted)
N$54  (2 unrouted)
N$55  (2 unrouted)
  Top 0.254: IC4.6 61.73,40.15 R44.2 59.6,39.67 R45.2
N$56  (2 unrouted)
N$57
  Top 0.254: Q1.C IC5.1
N$58  (1 unrouted)
N$59  (1 unrouted)
N$60  (2 unrouted)
N$61  (3 unrouted)
N$62  (2 unrouted)
N$63
  Top 0.254: R51.1 96.68,43.5 U$74.P$3
N$64  (1 unrouted)
  Top 0.254: R60.2 C32.2 | R61.1 108.05,50.47 106.97,49.39 106.34,49.39 105.73,49.99 IC8.9
N$65  (1 unrouted)
N$66  (1 unrouted)
N$67  (4 unrouted)
N$68  (1 unrouted)
N$69
  Top 0.254: U$74.P$1 100.22,46.26 R75.2 C38.2 | U$74.P$2 U$74.P$1 | R74.2 98.3,47.71 U$74.P$1
N$70
  Top 0.254: IC8.7 106.38,45.62 106.65,45.9 107.48,45.9 R63.2 R62.1 R64.2 111.1,41.9 111.1,40.81 109.32,39.04 C33.1
N$71
  Top 0.254: C33.2 108.05,37.51 107.29,38.27 107.29,40.37 R62.2 107.86,41.32 C39.2 105.73,43.45 IC8.6
N$72  (1 unrouted)
  Top 0.254: C39.1 R52.1
N$73  (1 unrouted)
  Top 0.254: D5.ANODE 110.13,47.49 D6.CATHODE 110.59,46.66 R63.1
N$74  (1 unrouted)
  Top 0.254: IC9.1 106.34,31.71 R65.1 C34.1 R79.2
N$75
  Top 0.254: D7.ANODE 110.78,32.87 D8.CATHODE 109.07,29.89 R79.1 105.16,29.89 104,31.06 104,31.45 IC9.5
N$76  (1 unrouted)
  Top 0.254: C34.2 R65.2 105.38,34.27 105.38,33.2 105.73,32.85 IC9.2
N$77
  Top 0.254: C35.2 R66.2 103.13,33.1 IC9.6 103.13,31 108.05,26.08 R80.1
N$78
  Top 0.254: R66.1 C35.1 99.67,34.27 99.67,32.37 R81.2 100.87,31.67 IC9.7 102.48,29.47 R67.2
N$79
  Top 0.254: R81.1 99.86,30.66 98.38,30.66 D12.ANODE 97.43,28.45 D9.CATHODE 99.03,26.84 103.48,26.84 103.8,26.53 103.8,25.85 IC9.10
N$80  (1 unrouted)
  Top 0.254: C36.1 R84.1 102.53,21.89 R83.2 R82.2
N$81
  Top 0.254: IC9.9 103.13,24.4 R84.2 C36.2 R67.1
N$82
  Top 0.254: D11.ANODE 110.78,25.25 D10.CATHODE 110.78,21.45 110.46,21.13 109.83,21.13 109,21.13 | IC9.12 105.08,24.37 105.38,24.06 105.38,21.77 106.02,21.13 109,21.13 | R82.1 109,21.13
N$83  (1 unrouted)
  Top 0.254: C40.2 R68.2 105.73,24.4 IC9.13
N$84  (1 unrouted)
  Top 0.254: R68.1 C40.1 109.09,23.13 109.09,24.4 108.56,24.94 106.65,24.94 106.38,25.21 IC9.14 | R77.1 R78.1
N$85
  Top 0.254: D4.CATHODE 98.08,36.67 D3.ANODE 98.38,38.27 99.86,38.27 R77.2 101.76,40.18 102.6,40.18 103.48,41.06 103.48,43.35 103.8,43.67 103.8,44.87 IC8.3
N$86  (via drill 0.3)  (1 unrouted)
  Top 0.254: R76.1 C41.2 v100.62,40.18 | R78.2 102.37,39.2 v101.61,39.2
  Bottom 0.254: v101.61,39.2 v100.62,40.18
N$87  (1 unrouted)
  Top 0.254: IC8.1 102.48,42.89 R76.2 C41.1 R75.1
N$88
  Top 0.254: C38.1 101.7,49.39 103.16,49.39 103.8,50.02 103.8,50.7 IC8.12 103.71,50.79 103.71,52.65 103.48,52.88 103.48,53.13 103.82,53.48 104.39,53.48 104.47,53.55 104.93,53.55 105.38,54.01 105.38,55.61 R73.2
N$89
  Top 0.254: IC8.14 102.48,51.02 101.57,51.93 | C37.1 101.57,53.33 101.57,51.93 | R70.2 101.76,57.33 100.16,57.33 99.67,56.83 99.67,52.24 99.99,51.93 101.57,51.93
N$90
  Top 0.254: IC8.13 103.13,52.15 C37.2 103.48,53.71 103.48,54.78 102.84,55.42 101.76,55.42 | 101.76,55.42 R71.2 | R72.1 100.62,53.06 101.34,53.78 101.34,55 101.76,55.42
N$91  (2 unrouted)
N$92  (1 unrouted)
N$93  (1 unrouted)
N$94  (2 unrouted)
N$95  (1 unrouted)
N$96  (2 unrouted)
N$97
  Top 0.254: IC10.13 95.41,52.24 R89.1 97.45,54.28 97.45,58.47 R87.2
N$98
  Top 0.254: R88.2 R90.1 96.68,55.29 94.91,53.52 IC10.14
N$106
  Top 0.254: IC5.13 49.82,45.77 | 49.82,45.77 R101.1 | R100.1 49.5,49.26 49.5,46.09 49.82,45.77
N$107  (1 unrouted)
  Top 0.254: IC5.14 R98.2
N$108  (1 unrouted)
  Top 0.254: IC5.12 51.09,45.26 51.41,45.58 51.41,49.26 R102.1
N$109
  Top 0.254: IC4.13 71.57,42.75 R103.1 C44.1
N$110
  Top 0.254: R104.1 C44.2 R103.2 70.69,43.4 IC4.14
N$111  (1 unrouted)
N$112  (2 unrouted)
N$113  (2 unrouted)
  Top 0.254: IC4.9 71.57,40.15 R107.2 R108.2
N$114
  Top 0.254: R105.2 R106.2 44.74,49.85 Q3.E
N$115
  Top 0.254: IC5.16 Q3.C
N$116
  Top 0.254: U$112.2 69.42,36.69 73,36.69 73.95,37.64 R108.1
N$117  (1 unrouted)
N$118  (2 unrouted)
OTA_CONTROL  (1 unrouted)
OTA_OUT  (3 unrouted)
OUTPUT_A  (3 unrouted)
OUTPUT_B  (3 unrouted)
OUTPUT_C  (3 unrouted)
OUTPUT_D  (3 unrouted)
OUTPUT_E  (2 unrouted)
OUTPUT_WS  (1 unrouted)
  Top 0.254: R71.1 R70.1
VCA_CV_IN1  (1 unrouted)
VCA_CV_IN2  (1 unrouted)
VCA_OUTPUT1  (3 unrouted)
VCA_OUTPUT2  (3 unrouted)
  Top 0.254: R91.1 R89.2
VCA_SIG_IN  (2 unrouted)

## Text on the board
tValues: <9v 12v>